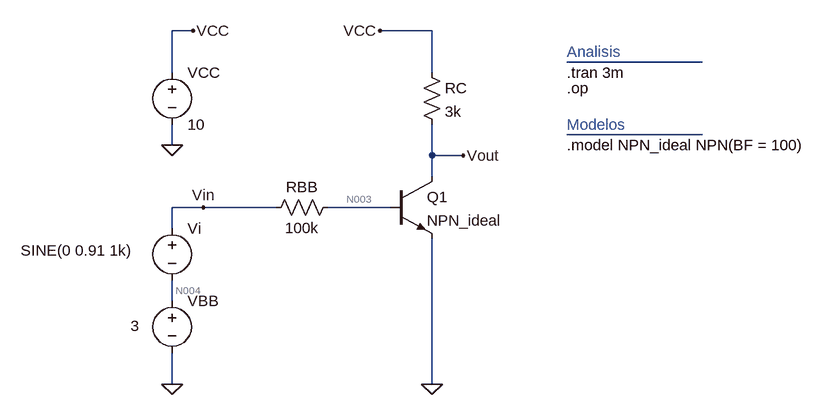
[diagram p0: schematic bjt_amp-ejemplo1.asc]
bjt_amp-ejemplo1.asc, the LTspice schematic file:
Version 4
SHEET 1 880 680
WIRE -288 -176 -320 -176
WIRE 80 -176 0 -176
WIRE 496 -128 288 -128
WIRE -320 -112 -320 -176
WIRE 80 -112 80 -176
WIRE 496 -16 288 -16
WIRE -320 0 -320 -32
WIRE 80 16 80 -32
WIRE 128 16 80 16
WIRE 80 48 80 16
WIRE -272 96 -320 96
WIRE -160 96 -272 96
WIRE 16 96 -80 96
WIRE -320 128 -320 96
WIRE -320 240 -320 208
WIRE -320 368 -320 320
WIRE 80 368 80 144
FLAG 80 368 0
FLAG -320 0 0
FLAG -288 -176 VCC
FLAG -320 368 0
FLAG 0 -176 VCC
FLAG 128 16 Vout
FLAG -272 96 Vin
SYMBOL npn 16 48 R0
SYMATTR InstName Q1
SYMATTR Value NPN_ideal
SYMBOL res -64 80 R90
WINDOW 0 0 56 VBottom 2
WINDOW 3 32 56 VTop 2
SYMATTR InstName RBB
SYMATTR Value 100k
SYMBOL res 64 -128 R0
SYMATTR InstName RC
SYMATTR Value 3k
SYMBOL voltage -320 -128 R0
WINDOW 123 0 0 Left 0
WINDOW 39 0 0 Left 0
SYMATTR InstName VCC
SYMATTR Value 10
SYMBOL voltage -320 112 R0
WINDOW 3 -233 50 Left 2
WINDOW 123 0 0 Left 0
WINDOW 39 0 0 Left 0
SYMATTR Value SINE(0 0.91 1k)
SYMATTR InstName Vi
SYMBOL voltage -320 224 R0
WINDOW 3 -64 54 Left 2
WINDOW 123 0 0 Left 0
WINDOW 39 0 0 Left 0
SYMATTR Value 3
SYMATTR InstName VBB
TEXT 288 -112 Left 2 !.tran 3m
TEXT 288 -144 Left 2 ;Analisis
TEXT 288 -88 Left 2 !.op
TEXT 288 0 Left 2 !.model NPN_ideal NPN(BF = 100)
TEXT 288 -32 Left 2 ;Modelos

The netlist it stands for:
* bjt_amp-ejemplo1.asc
Q1 Vout N003 0 0 NPN_ideal
RBB N003 Vin 100k
RC VCC Vout 3k
VCC VCC 0 10
Vi Vin N004 SINE(0 0.91 1k)
VBB N004 0 3
.model NPN NPN
.model PNP PNP
.lib standard.bjt
.tran 3m
* Analisis
.op
.model NPN_ideal NPN(BF = 100)
* Modelos
.backanno
.end

* Results of the author's LTspice run, read from the files saved beside the schematic
* Operating Point, zero values left out:
*   V(vout) = 3.384 V
*   V(n003) = 794.7 mV
*   V(vin) = 3 V
*   V(vcc) = 10 V
*   V(n004) = 3 V
*   Ic(Q1) = 2.205 mA
*   Ib(Q1) = 22.05 µA
*   Ie(Q1) = -2.227 mA
*   I(Rc) = 2.205 mA
*   I(Rbb) = -22.05 µA
*   I(Vbb) = -22.05 µA
*   I(Vi) = -22.05 µA
*   I(Vcc) = -2.205 mA
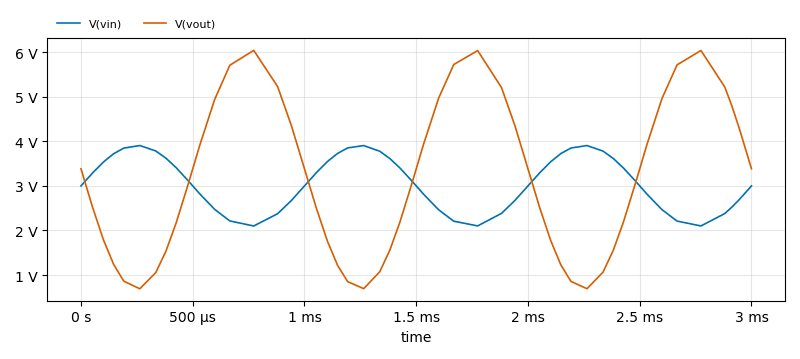
[diagram p1: Transient Analysis of bjt_amp-ejemplo1.asc, plotted from the saved traces]
* Transient Analysis, 1 run:
*   V(vin): min 2.1 V, max 3.907 V, average 3.005 V, rms 3.072 V, last 3 V
*   V(vout): min 690.7 mV, max 6.043 V, average 3.366 V, rms 3.859 V, last 3.384 V